# Altium schematic sheet PSU Board.SchDoc
size A4; Author: Fynn Raddatz; DrawnBy: Fynn Raddatz; DocumentNumber: 1; SheetNumber: 2; SheetTotal: 2
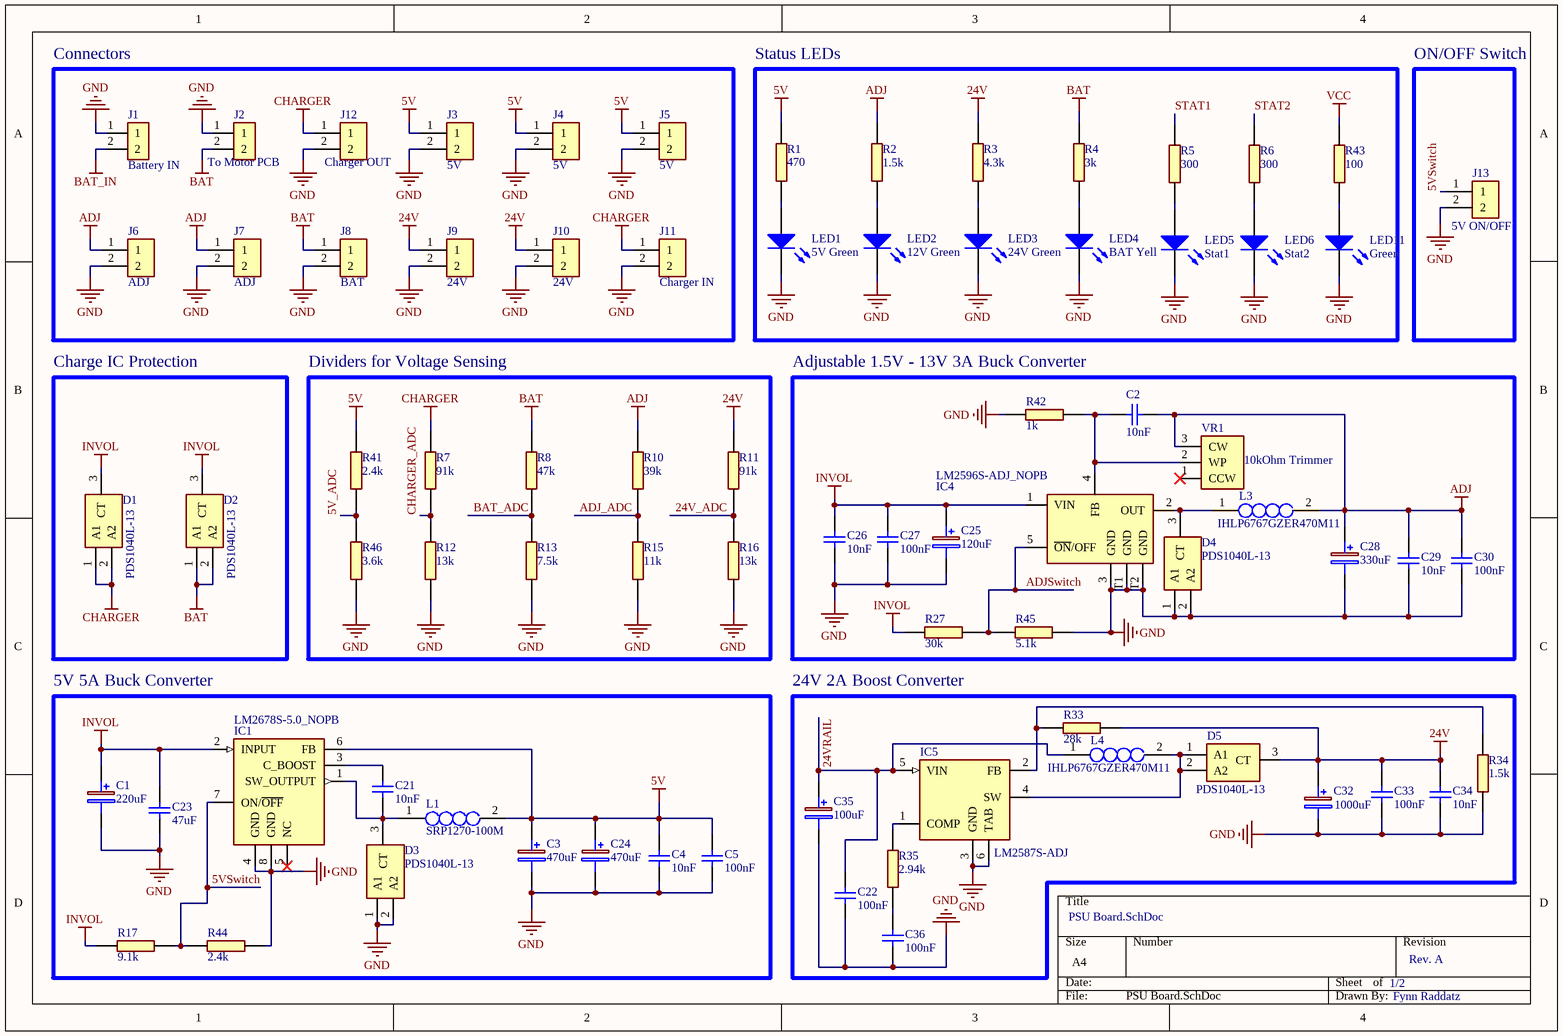
[diagram p0: PSU Board.SchDoc]

## Parts
C1  220uF  [CAPAE830X650N]
C2  10nF  [CAPC2012 METRIC]
C3  470uF  [CAPAE830X650N]
C4  10nF  [CAPC2012 METRIC]
C5  100nF  [CAPC2012 METRIC]
C21  10nF  [CAPC2012 METRIC]
C22  100nF  [CAPC2012 METRIC]
C23  47uF  [CAPC2012 METRIC]
C24  470uF  [CAPAE830X650N]
C25  120uF  [CAPAE830X650N]
C26  10nF  [CAPC2012 METRIC]
C27  100nF  [CAPC2012 METRIC]
C28  330uF  [CAPAE830X650N]
C29  10nF  [CAPC2012 METRIC]
C30  100nF  [CAPC2012 METRIC]
C32  1000uF  [CAPAE830X650N]
C33  100nF  [CAPC2012 METRIC]
C34  10nF  [CAPC2012 METRIC]
C35  100uF  [CAPAE830X650N]
C36  100nF  [CAPC2012 METRIC]
D1  PDS1040L-13  [POWERDI5]
D2  PDS1040L-13  [POWERDI5]
D3  PDS1040L-13  [POWERDI5]
D4  PDS1040L-13  [POWERDI5]
D5  PDS1040L-13  [POWERDI5]
IC1  LM2678S-5.0_NOPB  [TO127P1435X464-8N]
IC4  LM2596S-ADJ_NOPB  [LM2596SXADJ]
IC5  LM2587S-ADJ  [TO170P1435X465-6N]
J1  Battery IN  [XT30PB]
J2  To Motor PCB  [XT30PB]
J3  5V  [2 Pin Header BIG PADS]
J4  5V  [2 Pin Header BIG PADS]
J5  5V  [2 Pin Header BIG PADS]
J6  ADJ  [2 Pin Header BIG PADS]
J7  ADJ  [2 Pin Header BIG PADS]
J8  BAT  [2 Pin Header BIG PADS]
J9  24V  [2 Pin Header BIG PADS]
J10  24V  [2 Pin Header BIG PADS]
J11  Charger IN  [2 Pin Header BIG PADS]
J12  Charger OUT  [2 Pin Header BIG PADS]
J13  5V ON/OFF  [2 Pin Header BIG PADS]
L1  SRP1270-100M  [RSPRO_Spule10u]
L3  IHLP6767GZER470M11  [INDPM172172X700N]
L4  IHLP6767GZER470M11  [INDPM172172X700N]
LED1  5V Green  [1206_A]
LED2  12V Green  [1206_A]
LED3  24V Green  [1206_A]
LED4  BAT Yell  [1206_A]
LED5  Stat1  [1206_A]
LED6  Stat2  [1206_A]
LED11  Green  [1206_A]
R1  470  [RESC2012X65N]
R2  1.5k  [RESC2012X65N]
R3  4.3k  [RESC2012X65N]
R4  3k  [RESC2012X65N]
R5  300  [RESC2012X65N]
R6  300  [RESC2012X65N]
R7  91k  [RESC2012X65N]
R8  47k  [RESC2012X65N]
R10  39k  [RESC2012X65N]
R11  91k  [RESC2012X65N]
R12  13k  [RESC2012X65N]
R13  7.5k  [RESC2012X65N]
R15  11k  [RESC2012X65N]
R16  13k  [RESC2012X65N]
R17  9.1k  [RESC2012X65N]
R27  30k  [RESC2012X65N]
R33  28k  [RESC2012X65N]
R34  1.5k  [RESC2012X65N]
R35  2.94k  [RESC2012X65N]
R41  2.4k  [RESC2012X65N]
R42  1k  [RESC2012X65N]
R43  100  [RESC2012X65N]
R44  2.4k  [RESC2012X65N]
R45  5.1k  [RESC2012X65N]
R46  3.6k  [RESC2012X65N]
VR1  10kOhm Trimmer  [3296W-1]

## Blocks framed on the sheet
Connectors: J1-J12
Status LEDs: LED1-LED6 LED11 R1-R6 R43
ON/OFF Switch: J13
Charge IC Protection: D1 D2
Dividers for Voltage Sensing: R7 R8 R10-R13 R15 R16 R41 R46
Adjustable 1.5V - 13V 3A Buck Converter: C2 C25-C30 D4 IC4 L3 R27 R42 R45 VR1
5V 5A Buck Converter: C1 C3-C5 C21 C23 C24 D3 IC1 L1 R17 R44
24V 2A Boost Converter: C22 C32-C36 D5 IC5 L4 R33-R35

## Nets
5V: C3.1(+) C4.2 C5.2 C24.1(+) IC1.6(FB) J3.1 J4.1 J5.1 L1.2 R1.2 R41.2
24V: C32.1(+) C33.2 C34.2 D5.3(CT) J9.1 J10.1 R3.2 R11.2 R33.2
ADJ: C2.1 C28.1(+) C29.2 C30.2 J6.1 J7.1 L3.2 R2.2 R10.2 VR1.3(CW)
BAT: D2.1(A1) D2.2(A2) J2.2 J8.1 R4.2 R8.2
BAT_IN: J1.2
CHARGER: D1.1(A1) D1.2(A2) J11.1 J12.1 R7.2
GND: C1.2(-) C3.2(-) C4.1 C5.1 C22.1 C23.1 C24.2(-) C25.2(-) C26.1 C27.1 C28.2(-) C29.1 C30.1 C32.2(-) C33.1 C34.1 C35.2(-) C36.1 D3.1(A1) D3.2(A2) D4.1(A1) D4.2(A2) IC1.4(GND) IC1.8(GND) IC4.3(GND) IC4.T1(GND) IC4.T2(GND) IC5.3(GND) IC5.6(TAB) J1.1 J2.1 J3.2 J4.2 J5.2 J6.2 J7.2 J8.2 J9.2 J10.2 J11.2 J12.2 J13.2 LED1.1(K) LED2.1(K) LED3.1(K) LED4.1(K) LED5.1(K) LED6.1(K) LED11.1(K) R12.1 R13.1 R15.1 R16.1 R34.1 R42.2 R44.1 R45.1 R46.1
INVOL: C1.1(+) C23.2 C25.1(+) C26.2 C27.2 D1.3(CT) D2.3(CT) IC1.2(INPUT) IC4.1(VIN) R17.2 R27.2
VCC: R43.2
5V_ADC: R41.1 R46.2
5VSwitch: IC1.7(ON/~{OFF}) J13.1 R17.1 R44.2
24V_ADC: R11.1 R16.2
24VRAIL: C22.2 C35.1(+) IC5.5(VIN) L4.1
ADJ_ADC: R10.1 R15.2
ADJSwitch: IC4.5(~{ON}/OFF) R27.1 R45.2
BAT_ADC: R8.1 R13.2
CHARGER_ADC: R7.1 R12.2
STAT1: R5.2
STAT2: R6.2
NetC2_2: C2.2 IC4.4(FB) R42.1 VR1.2(WP)
NetC21_1: C21.1 D3.3(CT) IC1.1(SW_OUTPUT) L1.1
NetC21_2: C21.2 IC1.3(C_BOOST)
NetC36_2: C36.2 R35.2
NetD4_3: D4.3(CT) IC4.2(OUT) L3.1
NetD5_1: D5.1(A1) D5.2(A2) IC5.4(SW) L4.2
NetIC5_1: IC5.1(COMP) R35.1
NetIC5_2: IC5.2(FB) R33.1 R34.2
NetLED1_2: LED1.2(A) R1.1
NetLED2_2: LED2.2(A) R2.1
NetLED3_2: LED3.2(A) R3.1
NetLED4_2: LED4.2(A) R4.1
NetLED5_2: LED5.2(A) R5.1
NetLED6_2: LED6.2(A) R6.1
NetLED11_2: LED11.2(A) R43.1

Not connected (* = marked no-connect by the designer): IC1 5(NC)*; VR1 1(CCW)*

## Notes on the sheet
- 1/2
- Rev. A
- Fynn Raddatz

## Library data of the parts
C1 C3 C24 C25 C28 C32 C35 = EEE-FK1A221P: Capacitor Polarised; Manufacturer_Name: Panasonic; Datasheet Link: https://industrial.panasonic.com/cdbs/www-data/pdf/RDE0000/ABA0000C1181.pdf; Height: 6.5mm; Manufacturer_Part_Number: EEE-FK1A221P; Mouser Part Number: 667-EEE-FK1A221P; Mouser Price/Stock: https://www.mouser.co.uk/ProductDetail/Panasonic/EEE-FK1A221P?qs=qE6bgDGEOCsoedkYjAEKdg%3D%3D; Arrow Part Number: EEE-FK1A221P; Arrow Price/Stock: https://www.arrow.com/en/products/eee-fk1a221p/panasonic
C2 C4 C5 C21-C23 C26 C27 C29 C30 C33 C34 C36 = CL21B104KACNNNC: Capacitor; Manufacturer_Name: Samsung Electro-Mechanics; Datasheet Link: http://www.samsungsem.com/kr/support/product-search/mlcc/__icsFiles/afieldfile/2016/08/18/S_CL21B104KACNNNC.pdf; Height: 0.95mm; Manufacturer_Part_Number: CL21B104KACNNNC; Mouser Part Number: N/A; Mouser Price/Stock: https://www.mouser.co.uk/ProductDetail/Samsung-Electro-Mechanics/CL21B104KACNNNC?qs=yOVawPpwOwnhB47kNbieFw%3D%3D; Arrow Part Number: CL21B104KACNNNC; Arrow Price/Stock: https://www.arrow.com/en/products/cl21b104kacnnnc/samsung-electro-mechanics
D1-D5 = PDS1040L-13: Diode; Manufacturer_Name: Diodes Inc.; Datasheet Link: https://www.diodes.com/assets/Datasheets/ds30486.pdf; Manufacturer_Part_Number: PDS1040L-13; Mouser Part Number: 621-PDS1040L-13; Mouser Price/Stock: https://www.mouser.co.uk/ProductDetail/Diodes-Incorporated/PDS1040L-13?qs=rNZh4F5RthQSjKiPhlxJLw%3D%3D; Arrow Part Number: PDS1040L-13; Arrow Price/Stock: https://www.arrow.com/en/products/pds1040l-13/diodes-incorporated
IC1 = LM2678S-5.0_NOPB: Integrated Circuit; Manufacturer_Name: Texas Instruments; Manufacturer_Part_Number: LM2678S-5.0/NOPB; Datasheet Link: http://docs-emea.rs-online.com/webdocs/10fa/0900766b810fa439.pdf; Height: 4.64mm; Mouser Part Number: 926-LM2678S-5.0/NOPB; Mouser Price/Stock: https://www.mouser.co.uk/ProductDetail/Texas-Instruments/LM2678S-50-NOPB?qs=X1J7HmVL2ZEIcu2ww8kGrA%3D%3D; Arrow Part Number: LM2678S-5.0/NOPB; Arrow Price/Stock: https://www.arrow.com/en/products/lm2678s-5.0nopb/texas-instruments
IC4 = LM2596S-ADJ_NOPB: Integrated Circuit; Manufacturer_Name: Texas Instruments; Manufacturer_Part_Number: LM2596S-ADJ/NOPB; Datasheet Link: https://www.ti.com/lit/ds/symlink/lm2596.pdf?HQS=ti-null-null-sf-df-pf-sep-wwe&ts=1592978195629; Height: 4.57mm; Mouser Part Number: 926-LM2596S-ADJ/NOPB; Mouser Price/Stock: https://www.mouser.co.uk/ProductDetail/Texas-Instruments/LM2596S-ADJ-NOPB?qs=X1J7HmVL2ZHoMN0DLDcNog%3D%3D; Arrow Part Number: LM2596S-ADJ/NOPB; Arrow Price/Stock: https://www.arrow.com/en/products/lm2596s-adjnopb/texas-instruments?region=nac
IC5 = LM2587S-ADJ_NOPB: Integrated Circuit; Manufacturer_Name: Texas Instruments; Manufacturer_Part_Number: LM2587S-ADJ/NOPB; Datasheet Link: http://www.ti.com/lit/ds/symlink/lm2587.pdf; Height: 4.65mm; Mouser Part Number: 926-LM2587S-ADJ/NOPB; Mouser Price/Stock: https://www.mouser.co.uk/ProductDetail/Texas-Instruments/LM2587S-ADJ-NOPB?qs=X1J7HmVL2ZEPViE%252BXoggZw%3D%3D; Arrow Part Number: LM2587S-ADJ/NOPB; Arrow Price/Stock: https://www.arrow.com/en/products/lm2587s-adjnopb/texas-instruments
J1 J2 = XT30PB: Connector; Manufacturer_Name: Amass; Datasheet Link: https://www.tme.eu/Document/4acc913878197f8c2e30d4b8cdc47230/XT30UPB%20SPEC.pdf; Height: 10.7mm; Manufacturer_Part_Number: XT30PB
J3-J13 = 2 Pin Header Big Pad: Connector; Manufacturer_Name: Wurth Elektronik; Manufacturer_Part_Number: 61300211121; Datasheet Link: https://componentsearchengine.com/Datasheets/2/61300211121.pdf; Height: 8.54mm; Mouser Part Number: 710-61300211121; Mouser Price/Stock: https://www.mouser.co.uk/ProductDetail/Wurth-Elektronik/61300211121/?qs=t4813l51qx%252B1A5GYDQxPlw%3D%3D
L1 = SRP1270-100M: Inductor; Manufacturer_Name: Bourns; Datasheet Link: https://www.bourns.com/pdfs/SRP1270.pdf; Height: 7mm; Manufacturer_Part_Number: SRP1270-100M; Mouser Part Number: 652-SRP1270-100M; Mouser Price/Stock: https://www.mouser.co.uk/ProductDetail/Bourns/SRP1270-100M?qs=s%252BX%2FYkvGCpE5rFNaoMUDIw%3D%3D; Arrow Part Number: SRP1270-100M; Arrow Price/Stock: https://www.arrow.com/en/products/srp1270-100m/bourns
L3 L4 = IHLP6767GZER470M11: Inductor; Manufacturer_Name: Vishay; Datasheet Link: https://www.vishay.com/docs/34282/lp67gz11.pdf; Height: 7mm; Manufacturer_Part_Number: IHLP6767GZER470M11; Mouser Part Number: 70-IHLP6767GZER470M1; Mouser Price/Stock: https://www.mouser.co.uk/ProductDetail/Vishay-Dale/IHLP6767GZER470M11?qs=XqCRimLFoQtd31Wi9i7V1Q%3D%3D; Arrow Part Number: IHLP6767GZER470M11; Arrow Price/Stock: https://www.arrow.com/en/products/ihlp6767gzer470m11/vishay
LED1-LED6 LED11 = CMP-1426-00014-1: SMD mono-color Chip LED, WL-SMCW, Green; Manufacturer: Wuerth Elektronik; PartNumber: 150120GS75000; PackageReference: 1206_A; ComponentLink1Description: Manufacturer URL; ComponentLink2URL: http://katalog.we-online.com/led/datasheet/150120GS75000.pdf; ComponentLink2Description: Datasheet; Color: Green; ComponentLink1URL: http://www.we-online.com
R1-R8 R10-R13 R15-R17 R27 R33-R35 R41-R46 = Res 0805: Resistor; Manufacturer_Name: Stackpole Electronics Inc.; Manufacturer_Part_Number: RMCF0805ZT0R00; Datasheet Link: https://www.seielect.com/Catalog/SEI-RMCF_RMCP.pdf; Height: 0.65mm; Arrow Part Number: RMCF0805ZT0R00; Arrow Price/Stock: https://www.arrow.com/en/products/rmcf0805zt0r00/stackpole-electronics
VR1 = 3296W-1-103LF: Variable Resistor; Manufacturer_Name: Bourns; Datasheet Link: https://www.bourns.com/pdfs/3296.pdf; Manufacturer_Part_Number: 3296W-1-103LF; Mouser Part Number: 652-3296W-1-103LF; Mouser Price/Stock: https://www.mouser.co.uk/ProductDetail/Bourns/3296W-1-103LF?qs=CL3xLxiry19Id6AEaxYcng%3D%3D; Arrow Part Number: 3296W-1-103LF; Arrow Price/Stock: https://www.arrow.com/en/products/3296w-1-103lf/bourns?region=nac